# EAGLE schematic Top Board (EAGLE 9.5.1)
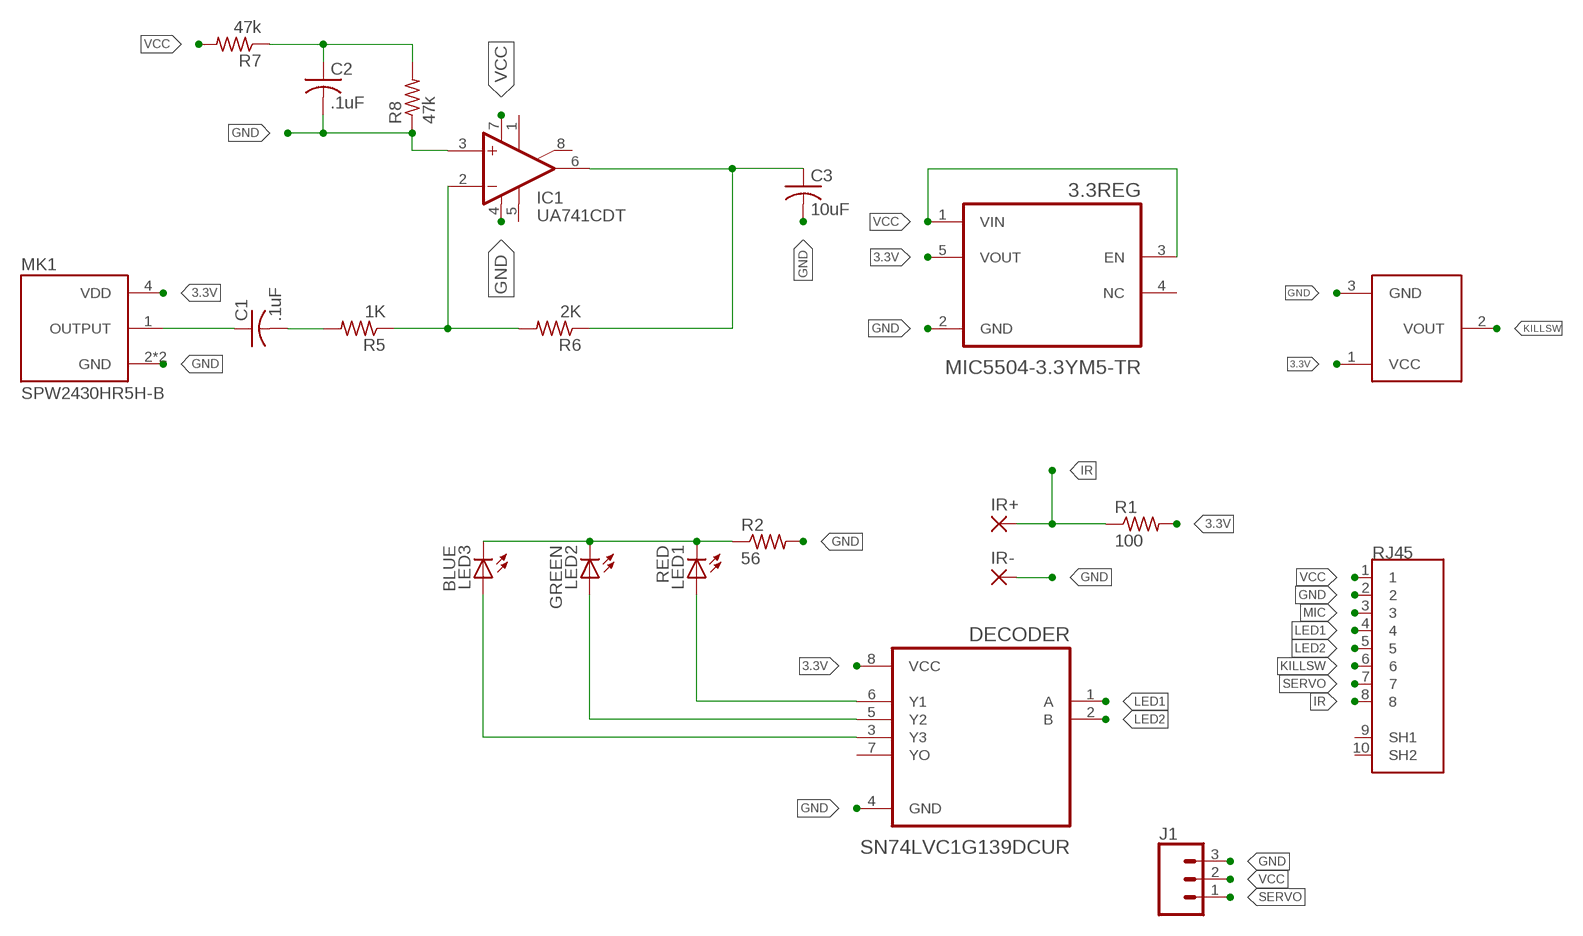
[diagram p0: schematic, sheet 1]

## Parts
3.3REG  MIC5504-3.3YM5-TR  [SOT95P280X145-5N]
AH9250  A1324LLHLT-T  [SOT-23W]
C1  .1uF  C-USC0805  [C0805]
C2  .1uF  C-USC0805  [C0805]
C3  10uF  C-USC0805  [C0805]
DECODER  SN74LVC1G139DCUR  [SOP50P310X90-8N]
IC1  UA741CDT  ICL7611BCSA  [SO08]
IR+  SMD5  [SMD2,54-5,08]
IR-  SMD5  [SMD2,54-5,08]
J1  CONN_03SMD_RA_MALE  [1X03_SMD_RA_MALE]
LED1  RED  LEDCHIP-LED0805  [CHIP-LED0805]
LED2  GREEN  LEDCHIP-LED0805  [CHIP-LED0805]
LED3  BLUE  LEDCHIP-LED0805  [CHIP-LED0805]
MK1  SPW2430HR5H-B  [MIC_SPW2430HR5H-B]
R1  100  R-US_R0805  [R0805]
R2  56  R-US_R0805  [R0805]
R5  1K  R-US_R0805  [R0805]
R6  2K  R-US_R0805  [R0805]
R7  47k  R-US_R0805  [R0805]
R8  47k  R-US_R0805  [R0805]
RJ45  0855437002  [MOLEX_0855437002]

## Nets
3.3V: 3.3REG.5(VOUT) AH9250.1(VCC) DECODER.8(VCC) MK1.4(VDD) R1.2
GND: 3.3REG.2(GND) AH9250.3(GND) C2.2 C3.2 DECODER.4(GND) IC1.3(+IN) IC1.4(V-) IR-.1(P) J1.3 MK1.2(GND) MK1.3(GND) R2.2 R8.1 RJ45.2
IR: IR+.1(P) R1.1 RJ45.8
KILLSW: AH9250.2(VOUT) RJ45.6
LED1: DECODER.1(A) RJ45.4
LED2: DECODER.2(B) RJ45.5
MIC: RJ45.3
N$1: LED1.C LED2.C LED3.C R2.1
N$3: C3.1 IC1.6(OUT) R6.1
N$8: DECODER.5(Y2) LED2.A
N$9: DECODER.3(Y3) LED3.A
N$10: DECODER.6(Y1) LED1.A
N$13: IC1.2(-IN) R5.1 R6.2
N$14: C1.2 R5.2
N$15: C1.1 MK1.1(OUTPUT)
N$16: C2.1 R7.1 R8.2
SERVO: J1.1 RJ45.7
VCC: 3.3REG.1(VIN) 3.3REG.3(EN) IC1.7(V+) J1.2 R7.2 RJ45.1
Unconnected: 3.3REG.4(NC) DECODER.7(YO) IC1.1(OFF1) IC1.5(OFF2) IC1.8(IOSET) RJ45.9(SH1) RJ45.10(SH2)

## Library data of the parts
3.3REG = MIC5504-3.3YM5-TR:MIC5504-3.3YM5-TR: None; AVAILABILITY: Unavailable; DESCRIPTION: Single 300mA LDO with Enable Pull-Down & Auto Discharge, 5 SOT-23 T/R; MF: Microchip; MP: MIC5504-3.3YM5-TR; PACKAGE: SOT-23 Microchip; PRICE: None
AH9250 = Sensor:A1324LLHLT-T: SENSOR HALL EFFECT ANALOG SOT23W Manufacturer's datasheet <https://www.digikey.in/product-detail/en/allegro-microsystems-llc/A1324LLHLT-T/620-1402-2-ND/2639989>; CREATED_BY: PCBLayout.com; DIGI_KEY_PART_NUMBER: 620-1402-1-ND; MANUFACTURER: Allegro MicroSystems, LLC; MPN: A1324LLHLT-T; PACKAGE: SOT-23W
C1-C3 = rcl:C-US: CAPACITOR, American symbol; SPICEPREFIX: C
DECODER = SN74LVC1G139DCUR:SN74LVC1G139DCUR: None; AVAILABILITY: Unavailable; DESCRIPTION: Decoder/Demultiplexer Single 2-to-4 8-Pin VSSOP T/R; MF: Texas Instruments; MP: SN74LVC1G139DCUR; PACKAGE: VFSOP-8 Texas Instruments; PRICE: None
IC1 = maxim:ICL7611: Single Operational Amplifiers Source: http://datasheets.maxim-ic.com/en/ds/ICL7612-ICL764X.pdf; MPN: ICL7611BCSA+T; OC_FARNELL: unknown; OC_NEWARK: 53K6532
IR+ IR- = wirepad:SMD5: SMD PAD
J1 = SparkFun-Connectors:CONN_03: Multi connection point. Often used as Generic Header-pin footprint for 0.1 inch spaced/style header connections On any of the 0.1 inch spaced packages, you can populate with these: Break Away Headers - Straight <https://www.sparkfun.com/products/116> (PRT-00116) Break Away Male Headers - Right Angle <https://www.sparkfun.com/products/553> (PRT-00553) Female Headers <https://www.sparkfun.com/products/115> (PRT-00115) Break Away Headers - Machine Pin <https://www.sparkfun.com/products/117> (PRT-00117) Break Away Female Headers - Swiss Machine Pin <https://www.sparkfun.com/products/743> (PRT-00743) Stackable Header - 3 Pin (Female, 0.1") <https://www.sparkfun.com/products/13875> (PRT-13875) For SCREWTERMINALS and SPRING TERMINALS visit here: Screw Terimnals on SparkFun.com <https://www.sparkfun.com/search/results?term=Screw+Terminals> (5mm/3.5mm/2.54mm spacing) This device is also useful as a general connection point to wire up your design to another part of your project. Our various solder wires solder well into these plated through hole pads. Hook-Up Wire - Assortment (Stranded, 22 AWG) <https://www.sparkfun.com/products/11375> (PRT-11375) Hook-Up Wire - Assortment (Solid Core, 22 AWG) <https://www.sparkfun.com/products/11367> (PRT-11367) View the entire wire category on our website here <https://www.sparkfun.com/categories/141> Special notes: Molex polarized connector foot print use with SKU : PRT-08232 with associated crimp pins and housings.; PROD_ID: CONN-10925
LED1-LED3 = adafruit:LED: LED OSRAM: - CHIPLED LG R971, LG N971, LY N971, LG Q971, LY Q971, LO R971, LY R971 LH N974, LH R974 LS Q976, LO Q976, LY Q976 LO Q996 - Hyper CHIPLED LW Q18S LB Q993, LB Q99A, LB R99A - SideLED LS A670, LO A670, LY A670, LG A670, LP A670 LB A673, LV A673, LT A673, LW A673 LH A674 LY A675 LS A676, LA A676, LO A676, LY A676, LW A676 LS A679, LY A679, LG A679 - Hyper Micro SIDELED® LS Y876, LA Y876, LO Y876, LY Y876 LT Y87S - SmartLED LW L88C, LW L88S LB L89C, LB L89S, LG L890 LS L89K, LO L89K, LY L89K LS L896, LA L896, LO L896, LY L896 - TOPLED LS T670, LO T670, LY T670, LG T670, LP T670 LSG T670, LSP T670, LSY T670, LOP T670, LYG T670 LG T671, LOG T671, LSG T671 LB T673, LV T673, LT T673, LW T673 LH T674 LS T676, LA T676, LO T676, LY T676, LB T676, LH T676, LSB T676, LW T676 LB T67C, LV T67C, LT T67C, LS T67K, LO T67K, LY T67K, LW E67C LS E67B, LA E67B, LO E67B, LY E67B, LB E67C, LV E67C, LT E67C LW T67C LS T679, LY T679, LG T679 LS T770, LO T770, LY T770, LG T770, LP T770 LB T773, LV T773, LT T773, LW T773 LH T774 LS E675, LA E675, LY E675, LS T675 LS T776, LA T776, LO T776, LY T776, LB T776 LHGB T686 LT T68C, LB T68C - Hyper Mini TOPLED® LB M676 - Mini TOPLED Santana® LG M470 LS M47K, LO M47K, LY M47K Source: http://www.osram.convergy.de/
MK1 = SPW2430HR5H-B:SPW2430HR5H-B: Mic Mems Analog; AVAILABILITY: Unavailable; DESCRIPTION: Mic Mems Analog; MF: Knowles; MP: SPW2430HR5H-B; PACKAGE: Knowles; PRICE: None
R1 R2 R5-R8 = rcl:R-US_: RESISTOR, American symbol; SPICEPREFIX: R
RJ45 = RJ45 WM14372CT-ND:0855437002: Conn Mod Jack 8p8c r/a Shielded; AVAILABILITY: Unavailable; DESCRIPTION: Conn Mod Jack 8p8c r/a Shielded; MF: Molex; MP: 0855437002; PACKAGE: None; PRICE: None